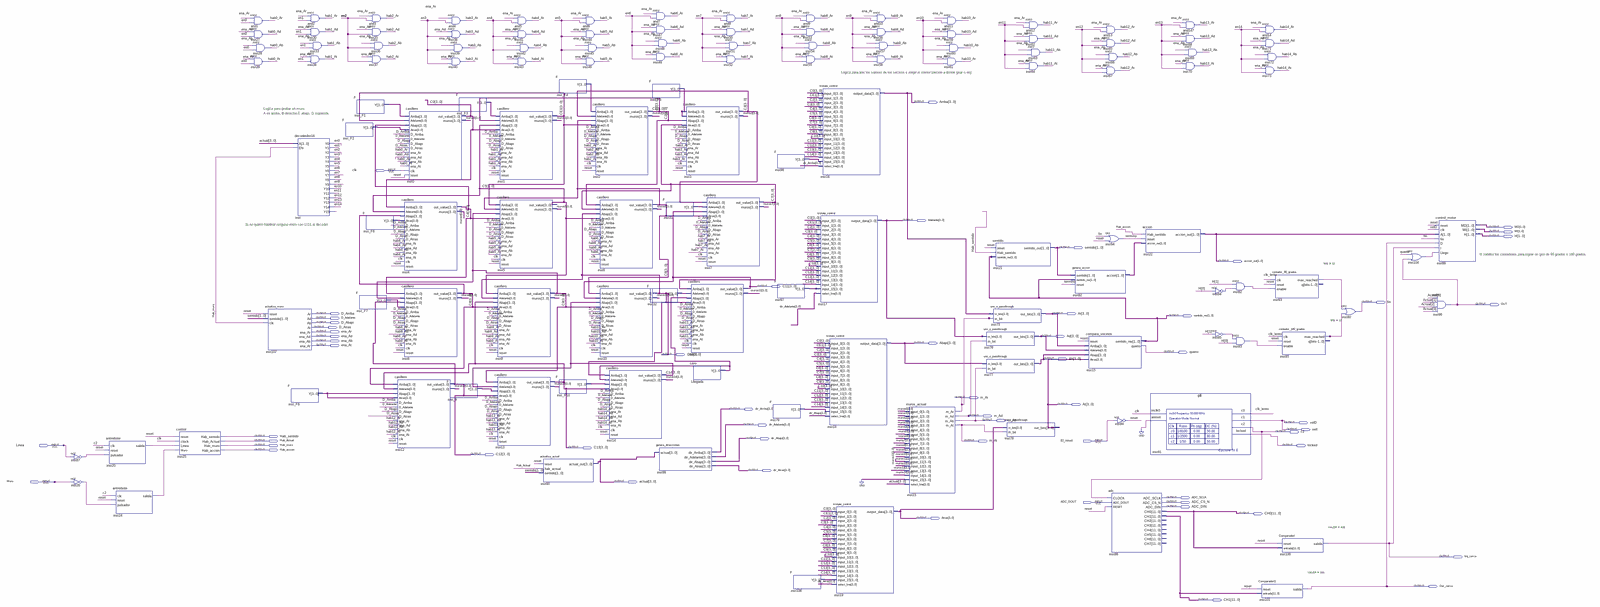
[diagram p0: schematic sheet, whole]
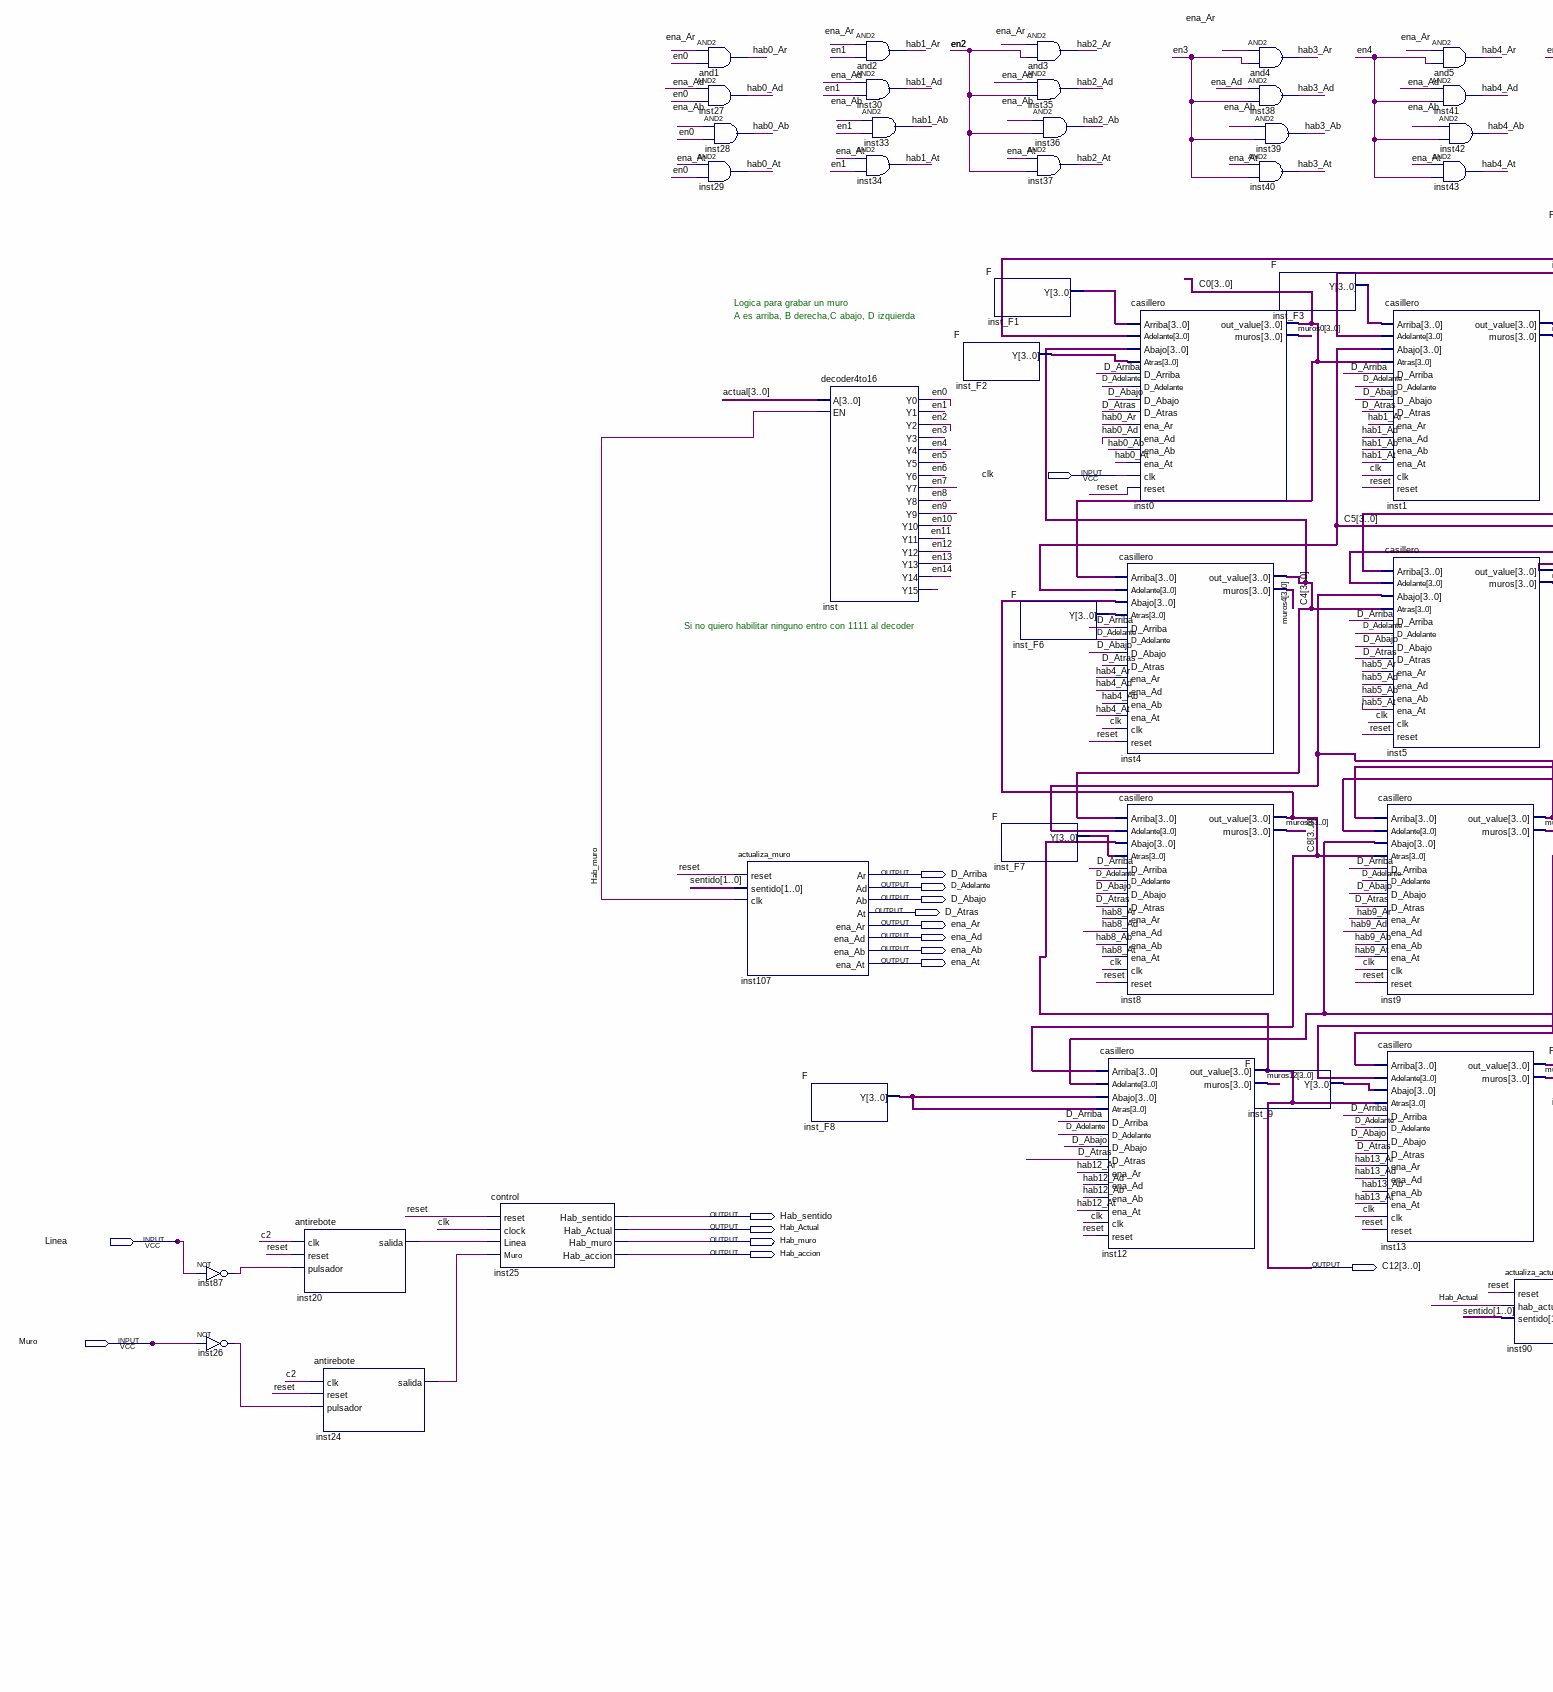
[diagram p1: schematic sheet, left part]
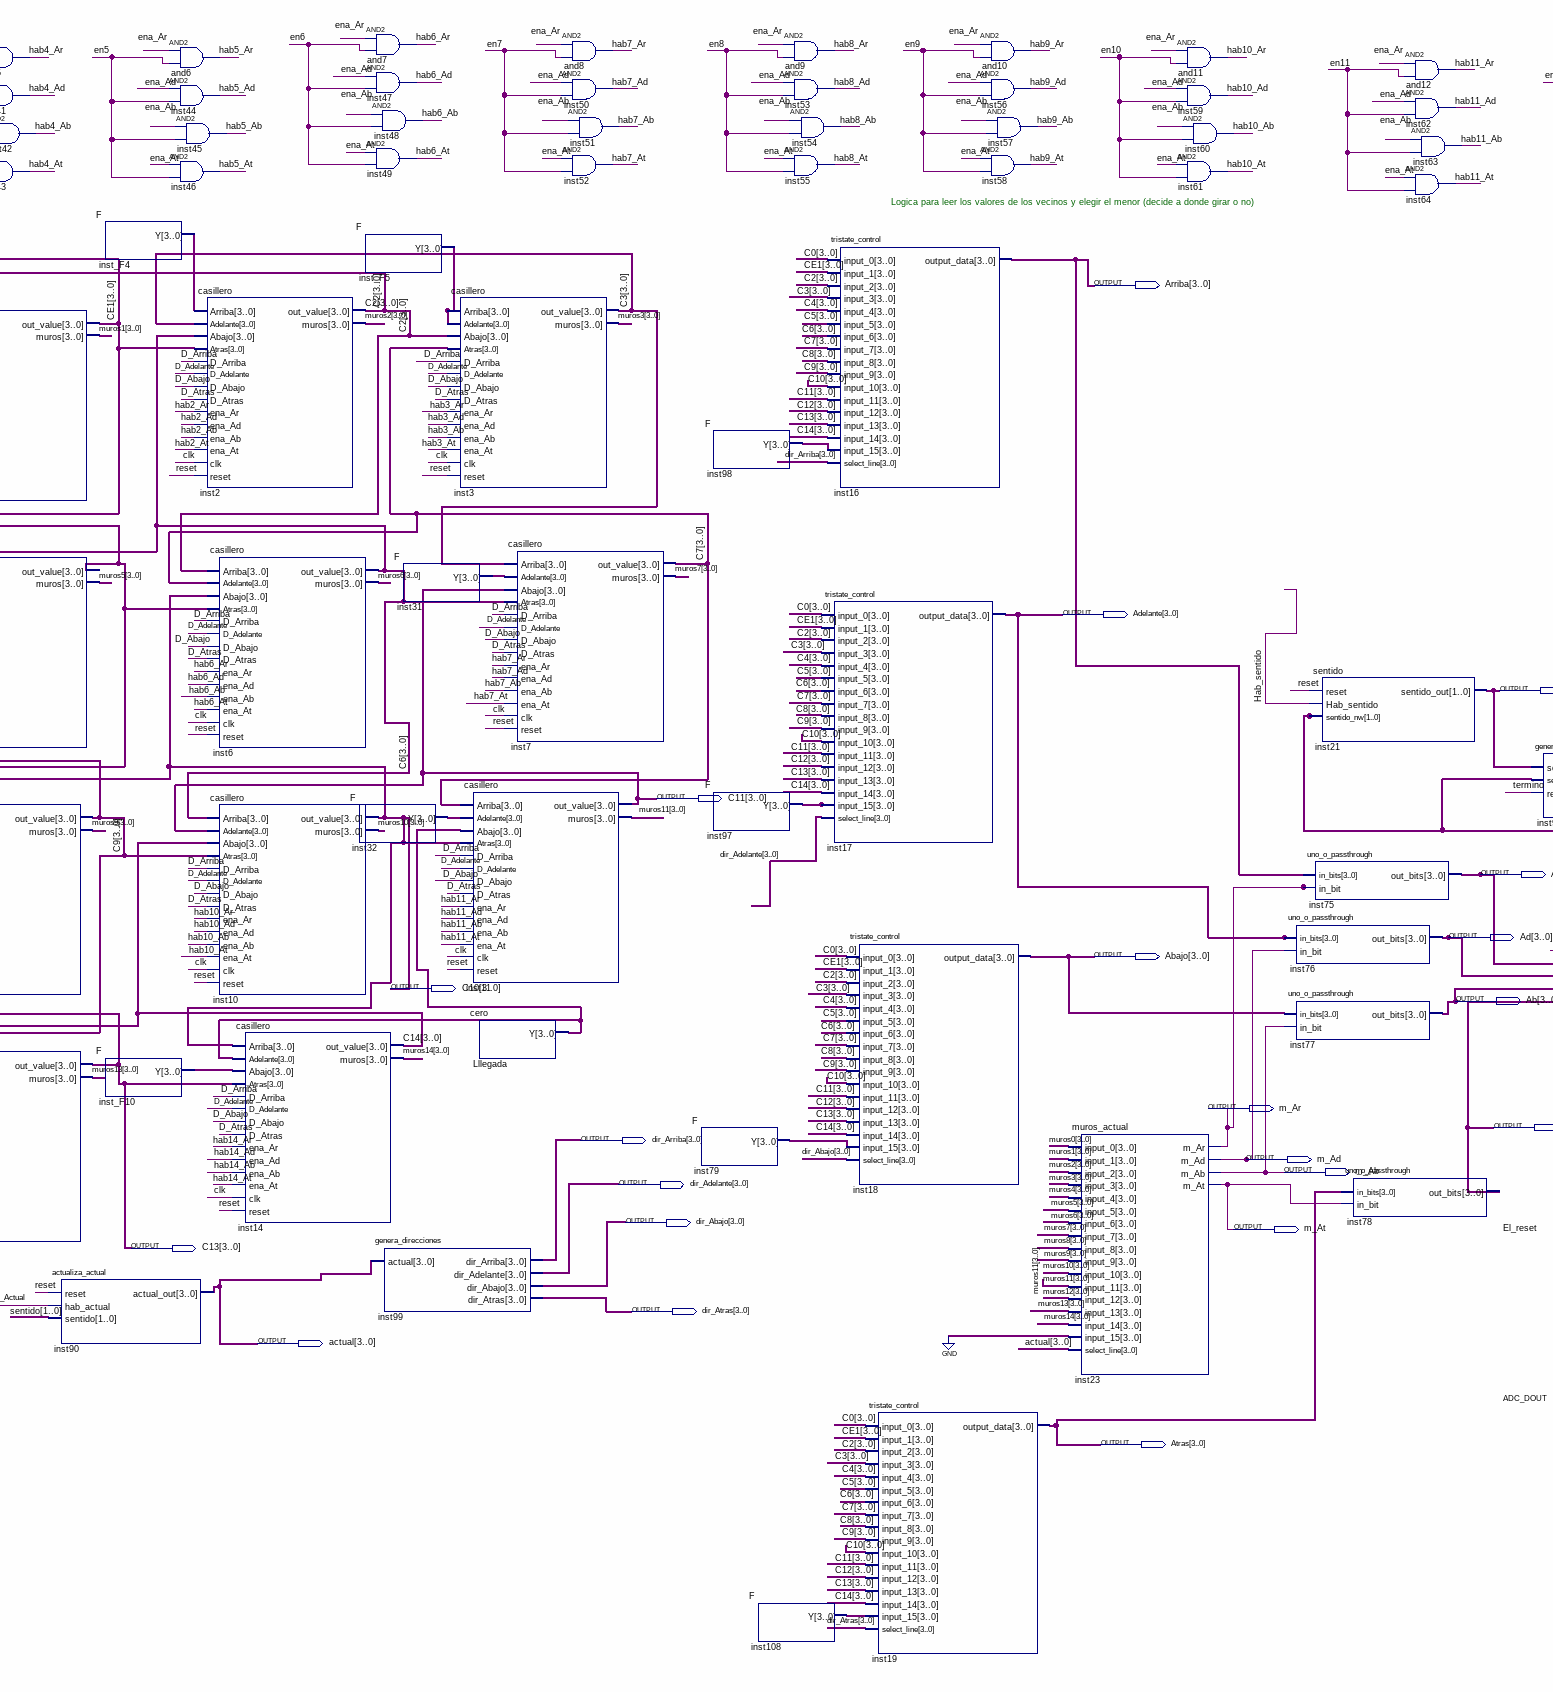
[diagram p2: schematic sheet, centre part]
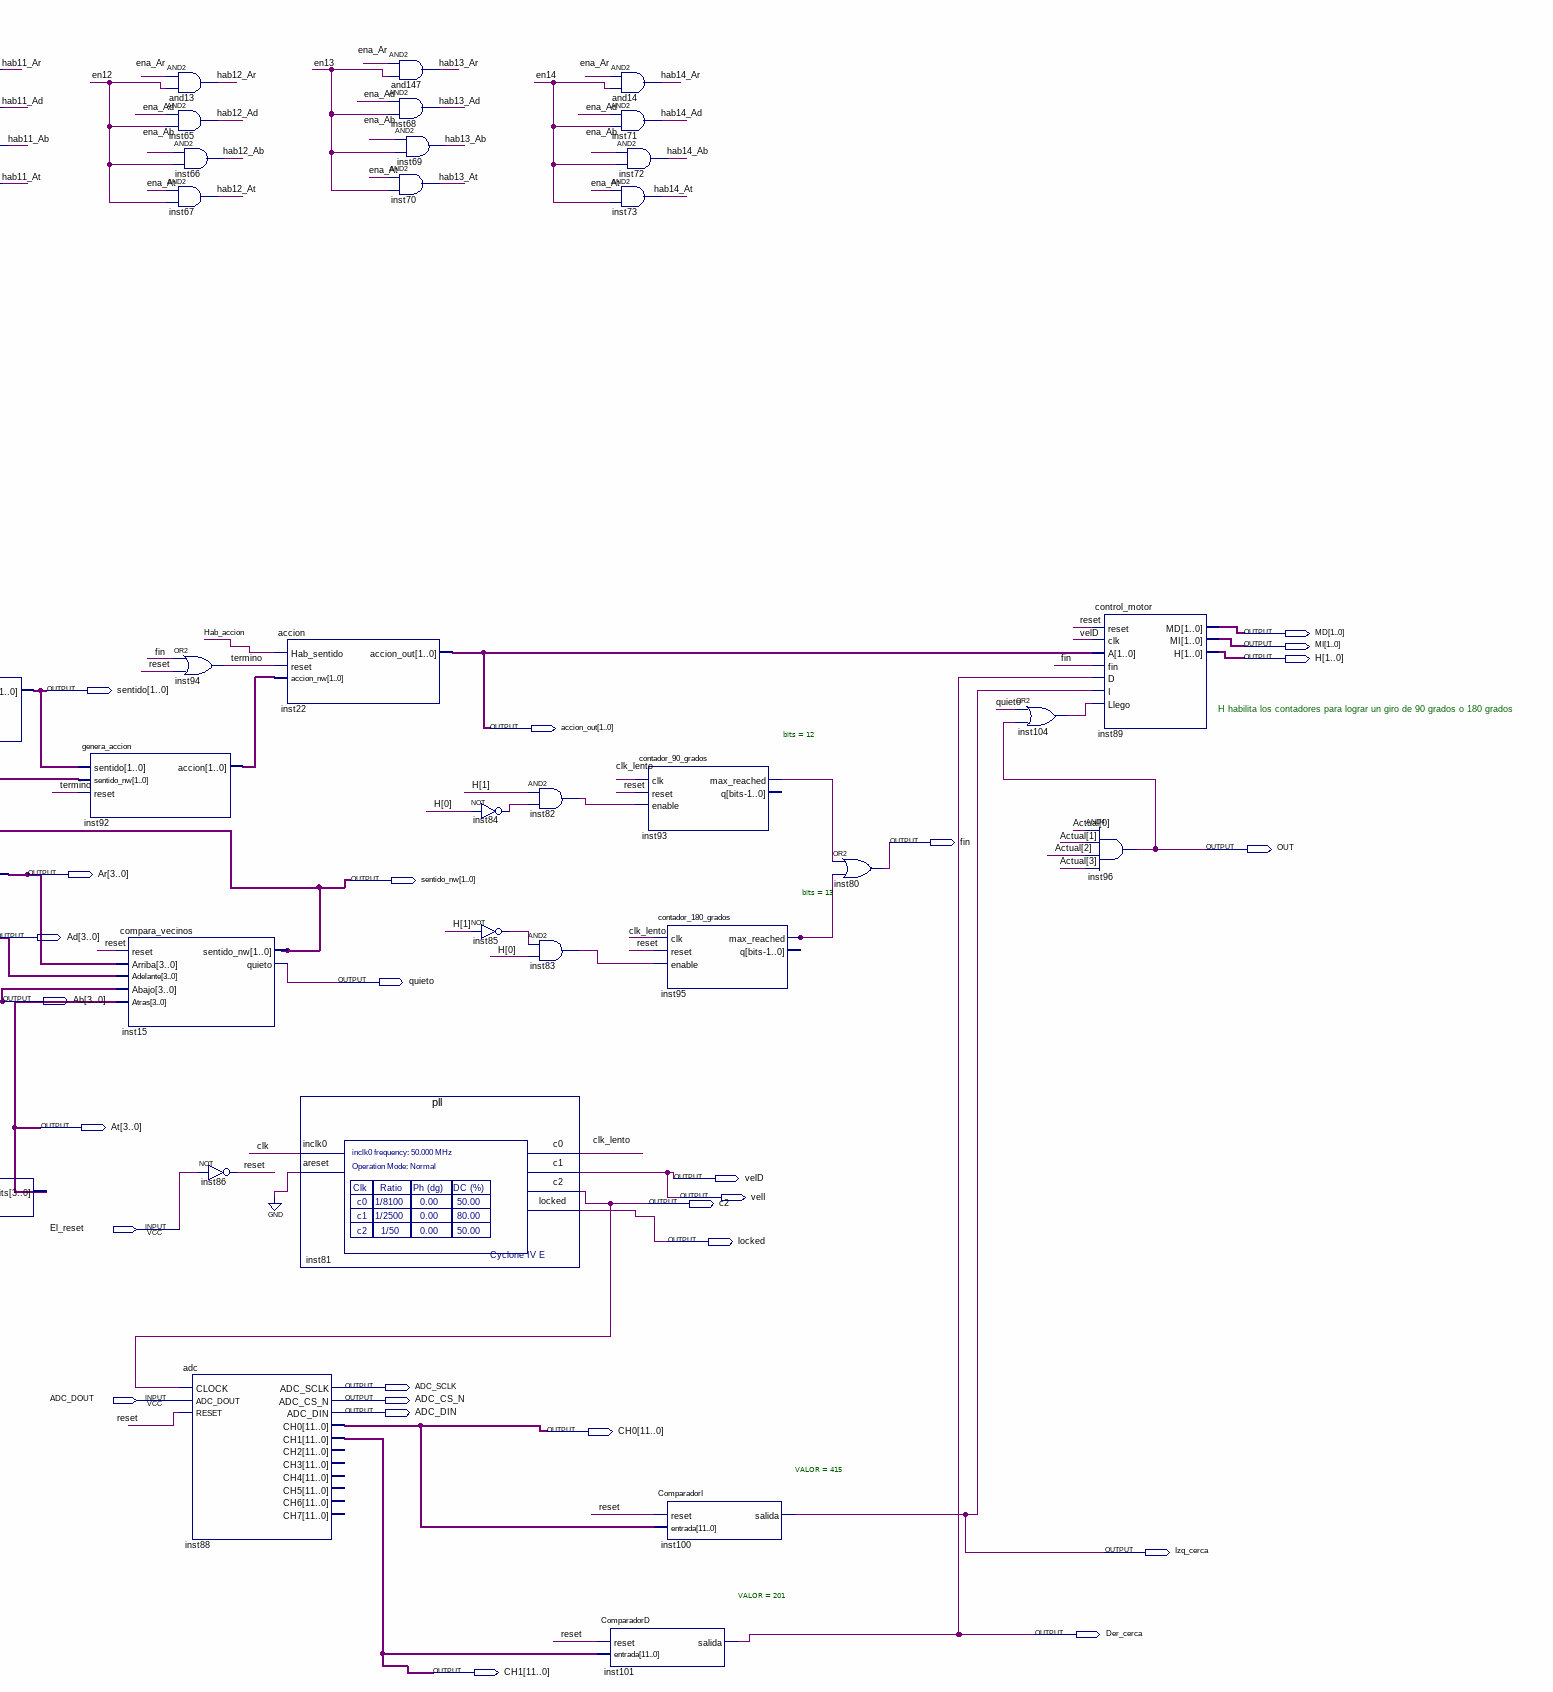
[diagram p3: schematic sheet, right part]
// Quartus schematic matriz.bdf as structural Verilog: 130 symbols, 58 pins
module matriz (
  input  clk,
  input  El_reset,
  input  Linea,
  input  Muro,
  input  ADC_DOUT,
  output [3:0] Arriba,
  output [3:0] Adelante,
  output [1:0] MD,
  output [1:0] MI,
  output [1:0] H,
  output [1:0] sentido,
  output [1:0] accion_out,
  output [3:0] C11,
  output fin,
  output OUT,
  output D_Arriba,
  output [3:0] Ar,
  output [1:0] sentido_nw,
  output D_Adelante,
  output D_Abajo,
  output D_Atras,
  output ena_Ar,
  output ena_Ad,
  output [3:0] Ad,
  output ena_Ab,
  output [3:0] Abajo,
  output ena_At,
  output quieto,
  output [3:0] C10,
  output [3:0] Ab,
  output m_Ar,
  output [3:0] At,
  output [3:0] dir_Arriba,
  output m_Ad,
  output m_Ab,
  output velD,
  output [3:0] dir_Adelante,
  output velI,
  output c2,
  output Hab_sentido,
  output [3:0] dir_Abajo,
  output Hab_Actual,
  output m_At,
  output Hab_muro,
  output locked,
  output [3:0] C13,
  output Hab_accion,
  output [3:0] C12,
  output [3:0] dir_Atras,
  output [3:0] actual,
  output ADC_SCLK,
  output ADC_CS_N,
  output ADC_DIN,
  output [11:0] CH0,
  output [3:0] Atras,
  output Izq_cerca,
  output Der_cerca,
  output [11:0] CH1
);

  wire clk_lento, en0, en1, en2, en3, en4, en5, en6, en7, en8, en9, en10, en11, en12, en13, en14, hab0_Ab,
       hab0_Ad, hab0_Ar, hab0_At, hab1_Ab, hab1_Ad, hab1_Ar, hab1_At, hab2_Ab, hab2_Ad, hab2_Ar, hab2_At,
       hab3_Ab, hab3_Ad, hab3_Ar, hab3_At, hab4_Ab, hab4_Ad, hab4_Ar, hab4_At, hab5_Ab, hab5_Ad, hab5_Ar,
       hab5_At, hab6_Ab, hab6_Ad, hab6_Ar, hab6_At, hab7_Ab, hab7_Ad, hab7_Ar, hab7_At, hab8_Ab, hab8_Ad,
       hab8_Ar, hab8_At, hab9_Ab, hab9_Ad, hab9_Ar, hab9_At, hab10_Ab, hab10_Ad, hab10_Ar, hab10_At,
       hab11_Ab, hab11_Ad, hab11_Ar, hab11_At, hab12_Ab, hab12_Ad, hab12_Ar, hab12_At, hab13_Ab, hab13_Ad,
       hab13_Ar, hab13_At, hab14_Ab, hab14_Ad, hab14_Ar, hab14_At, inst20_salida, inst24_salida, inst26_out,
       inst82_out, inst83_out, inst84_out, inst85_out, inst87_out, inst93_max_reached, inst95_max_reached,
       inst104_out, inst_y15, reset, termino;
  wire [1:0] inst92_accion;
  wire [3:0] C0, c2_bus, C3, C4, C5, C6, C7, C8, C9, C14, CE1, inst31_y, inst32_y, inst79_y, inst97_y,
       inst98_y, inst108_y, inst_9_y, inst_F1_y, inst_F2_y, inst_F3_y, inst_F4_y, inst_F5_y, inst_F6_y,
       inst_F7_y, inst_F8_y, inst_F10_y, Lllegada_y, muros0, muros1, muros2, muros3, muros4, muros5, muros6,
       muros7, muros8, muros9, muros10, muros11, muros12, muros13, muros14;

  not inst87 (inst87_out, Linea);
  not inst26 (inst26_out, Muro);
  antirebote inst20 (.clk(c2), .reset(reset), .pulsador(inst87_out), .salida(inst20_salida));
  antirebote inst24 (.clk(c2), .reset(reset), .pulsador(inst26_out), .salida(inst24_salida));
  control inst25 (
    .reset(reset), .clock(clk), .Linea(inst20_salida), .Muro(inst24_salida), .Hab_sentido(Hab_sentido),
    .Hab_Actual(Hab_Actual), .Hab_muro(Hab_muro), .Hab_accion(Hab_accion));
  and and1 (hab0_Ar, ena_Ar, en0);
  and inst27 (hab0_Ad, ena_Ad, en0);
  and inst28 (hab0_Ab, ena_Ab, en0);
  and inst29 (hab0_At, ena_At, en0);
  actualiza_muro inst107 (
    .reset(reset), .sentido(sentido), .clk(Hab_muro), .Ar(D_Arriba), .Ad(D_Adelante), .Ab(D_Abajo),
    .At(D_Atras), .ena_Ar(ena_Ar), .ena_Ad(ena_Ad), .ena_Ab(ena_Ab), .ena_At(ena_At));
  F inst_F8 (.Y(inst_F8_y));
  and and2 (hab1_Ar, ena_Ar, en1);
  and inst30 (hab1_Ad, ena_Ad, en1);
  and inst34 (hab1_At, ena_At, en1);
  decoder4to16 inst (
    .A(actual), .EN(Hab_muro), .Y0(en0), .Y1(en1), .Y2(en2), .Y3(en3), .Y4(en4), .Y5(en5), .Y6(en6),
    .Y7(en7), .Y8(en8), .Y9(en9), .Y10(en10), .Y11(en11), .Y12(en12), .Y13(en13), .Y14(en14), .Y15(inst_y15));
  and inst33 (hab1_Ab, ena_Ab, en1);
  F inst_F2 (.Y(inst_F2_y));
  F inst_F1 (.Y(inst_F1_y));
  F inst_F6 (.Y(inst_F6_y));
  F inst_F7 (.Y(inst_F7_y));
  and and3 (hab2_Ar, ena_Ar, en2);
  and inst35 (hab2_Ad, ena_Ad, en2);
  and inst36 (hab2_Ab, ena_Ab, en2);
  and inst37 (hab2_At, ena_At, en2);
  casillero inst12 (
    .Arriba(C8), .Adelante(C13), .Abajo(inst_F8_y), .Atras(inst_F8_y), .D_Arriba(D_Arriba),
    .D_Adelante(D_Adelante), .D_Abajo(D_Abajo), .D_Atras(D_Atras), .ena_Ar(hab12_Ar), .ena_Ad(hab12_Ad),
    .ena_Ab(hab12_Ab), .ena_At(hab12_At), .clk(clk), .reset(reset), .out_value(C12), .muros(muros12));
  casillero inst0 (
    .Arriba(inst_F1_y), .Adelante(CE1), .Abajo(C4), .Atras(inst_F2_y), .D_Arriba(D_Arriba),
    .D_Adelante(D_Adelante), .D_Abajo(D_Abajo), .D_Atras(D_Atras), .ena_Ar(hab0_Ar), .ena_Ad(hab0_Ad),
    .ena_Ab(hab0_Ab), .ena_At(hab0_At), .clk(clk), .reset(reset), .out_value(C0), .muros(muros0));
  casillero inst4 (
    .Arriba(C0), .Adelante(C5), .Abajo(C8), .Atras(inst_F6_y), .D_Arriba(D_Arriba), .D_Adelante(D_Adelante),
    .D_Abajo(D_Abajo), .D_Atras(D_Atras), .ena_Ar(hab4_Ar), .ena_Ad(hab4_Ad), .ena_Ab(hab4_Ab),
    .ena_At(hab4_At), .clk(clk), .reset(reset), .out_value(C4), .muros(muros4));
  casillero inst8 (
    .Arriba(C4), .Adelante(C9), .Abajo(C12), .Atras(inst_F7_y), .D_Arriba(D_Arriba), .D_Adelante(D_Adelante),
    .D_Abajo(D_Abajo), .D_Atras(D_Atras), .ena_Ar(hab8_Ar), .ena_Ad(hab8_Ad), .ena_Ab(hab8_Ab),
    .ena_At(hab8_At), .clk(clk), .reset(reset), .out_value(C8), .muros(muros8));
  and and4 (hab3_Ar, ena_Ar, en3);
  and inst38 (hab3_Ad, ena_Ad, en3);
  and inst39 (hab3_Ab, ena_Ab, en3);
  and inst40 (hab3_At, ena_At, en3);
  F inst_9 (.Y(inst_9_y));
  F inst_F3 (.Y(inst_F3_y));
  casillero inst1 (
    .Arriba(inst_F3_y), .Adelante(c2_bus), .Abajo(C5), .Atras(C0), .D_Arriba(D_Arriba),
    .D_Adelante(D_Adelante), .D_Abajo(D_Abajo), .D_Atras(D_Atras), .ena_Ar(hab1_Ar), .ena_Ad(hab1_Ad),
    .ena_Ab(hab1_Ab), .ena_At(hab1_At), .clk(clk), .reset(reset), .out_value(CE1), .muros(muros1));
  casillero inst5 (
    .Arriba(CE1), .Adelante(C6), .Abajo(C9), .Atras(C4), .D_Arriba(D_Arriba), .D_Adelante(D_Adelante),
    .D_Abajo(D_Abajo), .D_Atras(D_Atras), .ena_Ar(hab5_Ar), .ena_Ad(hab5_Ad), .ena_Ab(hab5_Ab),
    .ena_At(hab5_At), .clk(clk), .reset(reset), .out_value(C5), .muros(muros5));
  casillero inst9 (
    .Arriba(C5), .Adelante(C10), .Abajo(C13), .Atras(C8), .D_Arriba(D_Arriba), .D_Adelante(D_Adelante),
    .D_Abajo(D_Abajo), .D_Atras(D_Atras), .ena_Ar(hab9_Ar), .ena_Ad(hab9_Ad), .ena_Ab(hab9_Ab),
    .ena_At(hab9_At), .clk(clk), .reset(reset), .out_value(C9), .muros(muros9));
  casillero inst13 (
    .Arriba(C9), .Adelante(C14), .Abajo(inst_9_y), .Atras(C12), .D_Arriba(D_Arriba), .D_Adelante(D_Adelante),
    .D_Abajo(D_Abajo), .D_Atras(D_Atras), .ena_Ar(hab13_Ar), .ena_Ad(hab13_Ad), .ena_Ab(hab13_Ab),
    .ena_At(hab13_At), .clk(clk), .reset(reset), .out_value(C13), .muros(muros13));
  and and5 (hab4_Ar, ena_Ar, en4);
  and inst41 (hab4_Ad, ena_Ad, en4);
  and inst42 (hab4_Ab, ena_Ab, en4);
  and inst43 (hab4_At, ena_At, en4);
  actualiza_actual inst90 (.reset(reset), .hab_actual(Hab_Actual), .sentido(sentido), .actual_out(actual));
  F inst_F4 (.Y(inst_F4_y));
  F inst_F10 (.Y(inst_F10_y));
  and and6 (hab5_Ar, ena_Ar, en5);
  and inst44 (hab5_Ad, ena_Ad, en5);
  and inst45 (hab5_Ab, ena_Ab, en5);
  and inst46 (hab5_At, ena_At, en5);
  casillero inst2 (
    .Arriba(inst_F4_y), .Adelante(C3), .Abajo(C6), .Atras(CE1), .D_Arriba(D_Arriba), .D_Adelante(D_Adelante),
    .D_Abajo(D_Abajo), .D_Atras(D_Atras), .ena_Ar(hab2_Ar), .ena_Ad(hab2_Ad), .ena_Ab(hab2_Ab),
    .ena_At(hab2_At), .clk(clk), .reset(reset), .out_value(c2_bus), .muros(muros2));
  casillero inst6 (
    .Arriba(c2_bus), .Adelante(C7), .Abajo(C10), .Atras(C5), .D_Arriba(D_Arriba), .D_Adelante(D_Adelante),
    .D_Abajo(D_Abajo), .D_Atras(D_Atras), .ena_Ar(hab6_Ar), .ena_Ad(hab6_Ad), .ena_Ab(hab6_Ab),
    .ena_At(hab6_At), .clk(clk), .reset(reset), .out_value(C6), .muros(muros6));
  casillero inst10 (
    .Arriba(C6), .Adelante(C11), .Abajo(C14), .Atras(C9), .D_Arriba(D_Arriba), .D_Adelante(D_Adelante),
    .D_Abajo(D_Abajo), .D_Atras(D_Atras), .ena_Ar(hab10_Ar), .ena_Ad(hab10_Ad), .ena_Ab(hab10_Ab),
    .ena_At(hab10_At), .clk(clk), .reset(reset), .out_value(C10), .muros(muros10));
  casillero inst14 (
    .Arriba(C10), .Adelante(Lllegada_y), .Abajo(inst_F10_y), .Atras(C13), .D_Arriba(D_Arriba),
    .D_Adelante(D_Adelante), .D_Abajo(D_Abajo), .D_Atras(D_Atras), .ena_Ar(hab14_Ar), .ena_Ad(hab14_Ad),
    .ena_Ab(hab14_Ab), .ena_At(hab14_At), .clk(clk), .reset(reset), .out_value(C14), .muros(muros14));
  and and7 (hab6_Ar, ena_Ar, en6);
  and inst47 (hab6_Ad, ena_Ad, en6);
  and inst49 (hab6_At, ena_At, en6);
  F inst_F5 (.Y(inst_F5_y));
  F inst32 (.Y(inst32_y));
  and inst48 (hab6_Ab, ena_Ab, en6);
  F inst31 (.Y(inst31_y));
  genera_direcciones inst99 (
    .actual(actual), .dir_Arriba(dir_Arriba), .dir_Adelante(dir_Adelante), .dir_Abajo(dir_Abajo),
    .dir_Atras(dir_Atras));
  casillero inst3 (
    .Arriba(inst_F5_y), .Adelante(inst_F5_y), .Abajo(c2_bus), .Atras(C7), .D_Arriba(D_Arriba),
    .D_Adelante(D_Adelante), .D_Abajo(D_Abajo), .D_Atras(D_Atras), .ena_Ar(hab3_Ar), .ena_Ad(hab3_Ad),
    .ena_Ab(hab3_Ab), .ena_At(hab3_At), .clk(clk), .reset(reset), .out_value(C3), .muros(muros3));
  casillero inst11 (
    .Arriba(C7), .Adelante(inst32_y), .Abajo(Lllegada_y), .Atras(C10), .D_Arriba(D_Arriba),
    .D_Adelante(D_Adelante), .D_Abajo(D_Abajo), .D_Atras(D_Atras), .ena_Ar(hab11_Ar), .ena_Ad(hab11_Ad),
    .ena_Ab(hab11_Ab), .ena_At(hab11_At), .clk(clk), .reset(reset), .out_value(C11), .muros(muros11));
  cero Lllegada (.Y(Lllegada_y));
  casillero inst7 (
    .Arriba(C3), .Adelante(inst31_y), .Abajo(C11), .Atras(C6), .D_Arriba(D_Arriba), .D_Adelante(D_Adelante),
    .D_Abajo(D_Abajo), .D_Atras(D_Atras), .ena_Ar(hab7_Ar), .ena_Ad(hab7_Ad), .ena_Ab(hab7_Ab),
    .ena_At(hab7_At), .clk(clk), .reset(reset), .out_value(C7), .muros(muros7));
  and and8 (hab7_Ar, ena_Ar, en7);
  and inst50 (hab7_Ad, ena_Ad, en7);
  and inst51 (hab7_Ab, ena_Ab, en7);
  and inst52 (hab7_At, ena_At, en7);
  F inst98 (.Y(inst98_y));
  F inst97 (.Y(inst97_y));
  F inst79 (.Y(inst79_y));
  F inst108 (.Y(inst108_y));
  and and9 (hab8_Ar, ena_Ar, en8);
  and inst53 (hab8_Ad, ena_Ad, en8);
  and inst54 (hab8_Ab, ena_Ab, en8);
  and inst55 (hab8_At, ena_At, en8);
  tristate_control inst17 (
    .input_0(C0), .input_1(CE1), .input_2(c2_bus), .input_3(C3), .input_4(C4), .input_5(C5), .input_6(C6),
    .input_7(C7), .input_8(C8), .input_9(C9), .input_10(C10), .input_11(C11), .input_12(C12), .input_13(C13),
    .input_14(C14), .input_15(inst97_y), .select_line(dir_Adelante), .output_data(Adelante));
  tristate_control inst16 (
    .input_0(C0), .input_1(CE1), .input_2(c2_bus), .input_3(C3), .input_4(C4), .input_5(C5), .input_6(C6),
    .input_7(C7), .input_8(C8), .input_9(C9), .input_10(C10), .input_11(C11), .input_12(C12), .input_13(C13),
    .input_14(C14), .input_15(inst98_y), .select_line(dir_Arriba), .output_data(Arriba));
  tristate_control inst18 (
    .input_0(C0), .input_1(CE1), .input_2(c2_bus), .input_3(C3), .input_4(C4), .input_5(C5), .input_6(C6),
    .input_7(C7), .input_8(C8), .input_9(C9), .input_10(C10), .input_11(C11), .input_12(C12), .input_13(C13),
    .input_14(C14), .input_15(inst79_y), .select_line(dir_Abajo), .output_data(Abajo));
  tristate_control inst19 (
    .input_0(C0), .input_1(CE1), .input_2(c2_bus), .input_3(C3), .input_4(C4), .input_5(C5), .input_6(C6),
    .input_7(C7), .input_8(C8), .input_9(C9), .input_10(C10), .input_11(C11), .input_12(C12), .input_13(C13),
    .input_14(C14), .input_15(inst108_y), .select_line(dir_Atras), .output_data(Atras));
  and and10 (hab9_Ar, ena_Ar, en9);
  and inst56 (hab9_Ad, ena_Ad, en9);
  and inst57 (hab9_Ab, ena_Ab, en9);
  and inst58 (hab9_At, ena_At, en9);
  muros_actual inst23 (
    .input_0(muros0), .input_1(muros1), .input_2(muros2), .input_3(muros3), .input_4(muros4),
    .input_5(muros5), .input_6(muros6), .input_7(muros7), .input_8(muros8), .input_9(muros9),
    .input_10(muros10), .input_11(muros11), .input_12(muros12), .input_13(muros13), .input_14(muros14),
    .input_15(4'b0000), .select_line(actual), .m_Ar(m_Ar), .m_Ad(m_Ad), .m_Ab(m_Ab), .m_At(m_At));
  and and11 (hab10_Ar, ena_Ar, en10);
  and inst59 (hab10_Ad, ena_Ad, en10);
  and inst61 (hab10_At, ena_At, en10);
  and inst60 (hab10_Ab, ena_Ab, en10);
  sentido inst21 (.reset(reset), .Hab_sentido(Hab_sentido), .sentido_nw(sentido_nw), .sentido_out(sentido));
  uno_o_passthrough inst75 (.in_bits(Arriba), .in_bit(m_Ar), .out_bits(Ar));
  uno_o_passthrough inst76 (.in_bits(Adelante), .in_bit(m_Ad), .out_bits(Ad));
  uno_o_passthrough inst77 (.in_bits(Abajo), .in_bit(m_Ab), .out_bits(Ab));
  uno_o_passthrough inst78 (.in_bits(Atras), .in_bit(m_At), .out_bits(At));
  and and12 (hab11_Ar, ena_Ar, en11);
  and inst62 (hab11_Ad, ena_Ad, en11);
  and inst63 (hab11_Ab, ena_Ab, en11);
  and inst64 (hab11_At, ena_At, en11);
  genera_accion inst92 (.sentido(sentido), .sentido_nw(sentido_nw), .reset(termino), .accion(inst92_accion));
  compara_vecinos inst15 (
    .reset(reset), .Arriba(Ar), .Adelante(Ad), .Abajo(Ab), .Atras(At), .sentido_nw(sentido_nw),
    .quieto(quieto));
  and and13 (hab12_Ar, ena_Ar, en12);
  and inst65 (hab12_Ad, ena_Ad, en12);
  and inst66 (hab12_Ab, ena_Ab, en12);
  and inst67 (hab12_At, ena_At, en12);
  or inst94 (termino, fin, reset);
  adc inst88 (
    .CLOCK(c2), .ADC_DOUT(ADC_DOUT), .RESET(reset), .ADC_SCLK(ADC_SCLK), .ADC_CS_N(ADC_CS_N),
    .ADC_DIN(ADC_DIN), .CH0(CH0), .CH1(CH1));  // open: CH2, CH3, CH4, CH5, CH6, CH7
  not inst86 (reset, El_reset);
  accion inst22 (.Hab_sentido(Hab_accion), .reset(termino), .accion_nw(inst92_accion), .accion_out(accion_out));
  pll inst81 (.inclk0(clk), .areset(1'b0), .c0(clk_lento), .c1(velD), .c2(c2), .locked(locked));
  and and147 (hab13_Ar, ena_Ar, en13);
  and inst68 (hab13_Ad, ena_Ad, en13);
  and inst69 (hab13_Ab, ena_Ab, en13);
  and inst70 (hab13_At, ena_At, en13);
  not inst84 (inst84_out, H[0]);
  not inst85 (inst85_out, H[1]);
  and inst82 (inst82_out, H[1], inst84_out);
  and inst83 (inst83_out, inst85_out, H[0]);
  and and14 (hab14_Ar, ena_Ar, en14);
  and inst71 (hab14_Ad, ena_Ad, en14);
  and inst72 (hab14_Ab, ena_Ab, en14);
  and inst73 (hab14_At, ena_At, en14);
  contador_90_grados #(.bits(12)) inst93 (
    .clk(clk_lento), .reset(reset), .enable(inst82_out), .max_reached(inst93_max_reached));  // open: q
  ComparadorD #(.VALOR(201)) inst101 (.reset(reset), .entrada(CH1), .salida(Der_cerca));
  contador_180_grados #(.bits(13)) inst95 (
    .clk(clk_lento), .reset(reset), .enable(inst83_out), .max_reached(inst95_max_reached));  // open: q
  ComparadorI #(.VALOR(415)) inst100 (.reset(reset), .entrada(CH0), .salida(Izq_cerca));
  or inst80 (fin, inst93_max_reached, inst95_max_reached);
  or inst104 (inst104_out, quieto, OUT);
  control_motor inst89 (
    .reset(reset), .clk(velD), .A(accion_out), .fin(fin), .D(Der_cerca), .I(Izq_cerca), .Llego(inst104_out),
    .MD(MD), .MI(MI), .H(H));
  and inst96 (OUT, actual[0], actual[1], actual[2], actual[3]);

  assign velI = velD;

  // Notes on the sheet:
  //   Logica para leer los valores de los vecinos y elegir el menor (decide a donde girar o no)
  //   Logica para grabar un muro
  //   A es arriba, B derecha,C abajo, D izquierda
  //   Si no quiero habilitar ninguno entro con 1111 al decoder
  //   H habilita los contadores para lograr un giro de 90 grados o 180 grados
endmodule
